# Altium schematic sheet TFT-Display.SchDoc
size B; SheetNumber: 13; SheetTotal: 17
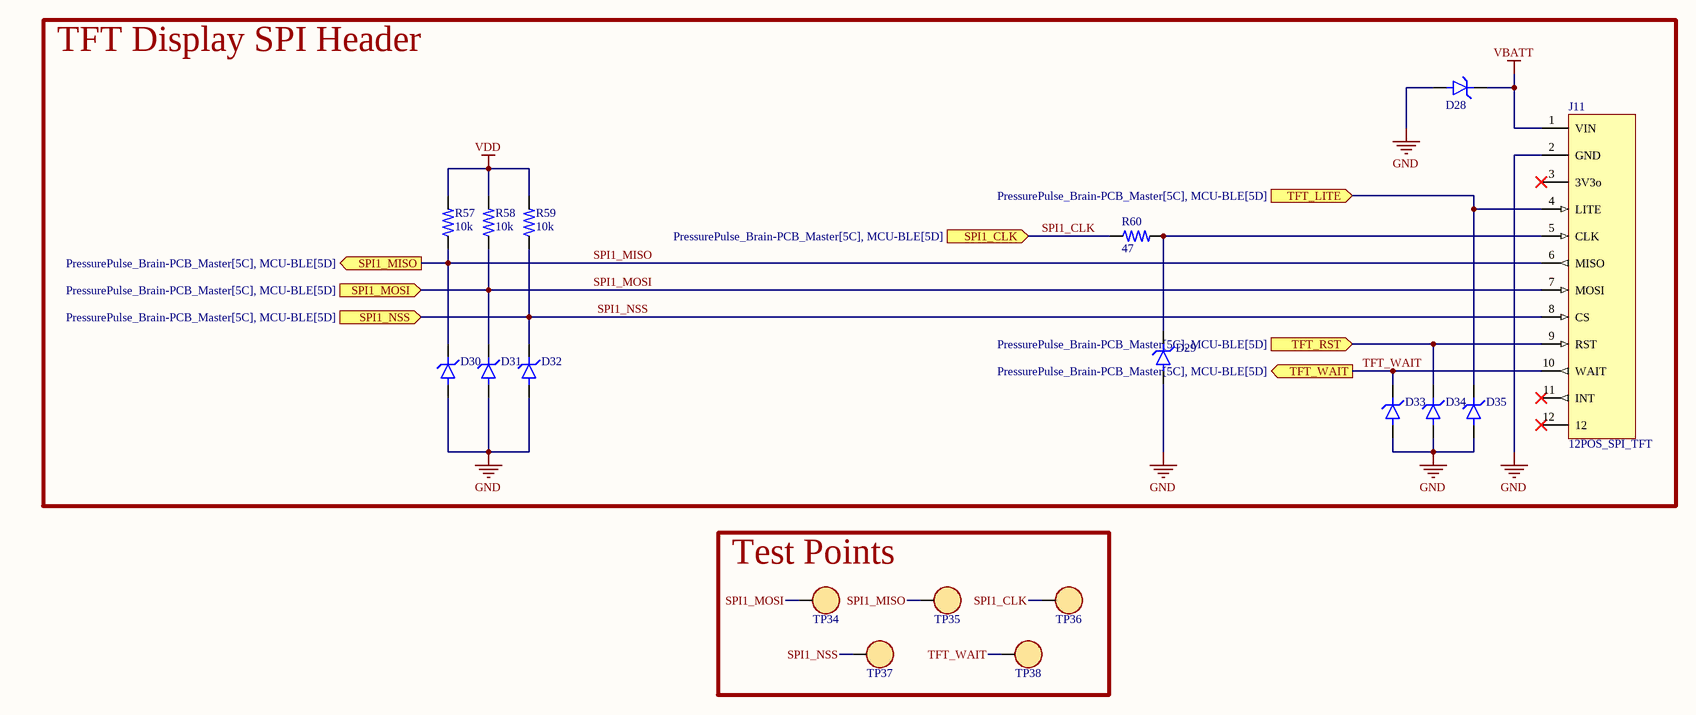
[diagram p0: TFT-Display.SchDoc]

## Parts
D28  RCLAMP0521P.TCT  [BDFN2C051V40]  (value not drawn)
D29  RCLAMP0521P.TCT  [BDFN2C051V40]  (value not drawn)
D30  RCLAMP0521P.TCT  [BDFN2C051V40]  (value not drawn)
D31  RCLAMP0521P.TCT  [BDFN2C051V40]  (value not drawn)
D32  RCLAMP0521P.TCT  [BDFN2C051V40]  (value not drawn)
D33  RCLAMP0521P.TCT  [BDFN2C051V40]  (value not drawn)
D34  RCLAMP0521P.TCT  [BDFN2C051V40]  (value not drawn)
D35  RCLAMP0521P.TCT  [BDFN2C051V40]  (value not drawn)
J11  12POS_SPI_TFT  [2.54MM-12POS_TFT]
R57  value 10k  [0402R]  (hidden comment: RES)
R58  value 10k  [0402R]  (hidden comment: RES)
R59  value 10k  [0402R]  (hidden comment: RES)
R60  value 47  [0402R]  (hidden comment: RES)
TP34  RH-5019  [TP - RH-5019]  (value not drawn)
TP35  RH-5019  [TP - RH-5019]  (value not drawn)
TP36  RH-5019  [TP - RH-5019]  (value not drawn)
TP37  RH-5019  [TP - RH-5019]  (value not drawn)
TP38  RH-5019  [TP - RH-5019]  (value not drawn)

## Blocks framed on the sheet
TFT Display SPI Header: D28-D35 J11 R57-R60
Test Points: TP34-TP38

## Ports
SPI1_CLK (in, see PressurePulse_Brain-PCB_Master[5C], MCU-BLE[5D]), SPI1_MISO (out, see PressurePulse_Brain-PCB_Master[5C], MCU-BLE[5D]), SPI1_MOSI (in, see PressurePulse_Brain-PCB_Master[5C], MCU-BLE[5D]), SPI1_NSS (in, see PressurePulse_Brain-PCB_Master[5C], MCU-BLE[5D]), TFT_LITE (in, see PressurePulse_Brain-PCB_Master[5C], MCU-BLE[5D]), TFT_RST (in, see PressurePulse_Brain-PCB_Master[5C], MCU-BLE[5D]), TFT_WAIT (out, see PressurePulse_Brain-PCB_Master[5C], MCU-BLE[5D])

## Nets
GND: D28.A D29.A D30.A D31.A D32.A D33.A D34.A D35.A J11.2(GND)
VBATT: D28.K J11.1(VIN)
VDD: R57.2 R58.2 R59.2
SPI1_CLK: R60.1 TP36.1 ; port SPI1_CLK
SPI1_MISO: D30.K J11.6(MISO) R57.1 TP35.1 ; port SPI1_MISO
SPI1_MOSI: D31.K J11.7(MOSI) R58.1 TP34.1 ; port SPI1_MOSI
SPI1_NSS: D32.K J11.8(CS) R59.1 TP37.1 ; port SPI1_NSS
TFT_LITE: D35.K J11.4(LITE) ; port TFT_LITE
TFT_RST: D34.K J11.9(RST) ; port TFT_RST
TFT_WAIT: D33.K J11.10(WAIT) TP38.1 ; port TFT_WAIT
NetD29_K: D29.K J11.5(CLK) R60.2

Not connected (* = marked no-connect by the designer): J11 3(3V3o)* 11(INT)* 12*

## Library data of the parts
D28-D35 = TVS DIODE: 25V Clamp 4A (8/20µs) Ipp Tvs Diode Surface Mount SLP1006P2; MFR: BORN; Type: SMD; Value: BDFN2C051V40; MFR PN: BDFN2C051V40; JLCPCB PN: C152023
J11 = 12POS_SPI_TFT: Value: DNS; MFR: *; MFR PN: *; JLCPCB PN: *
R57-R60 = RES: Resistor; MFR PN: *; MFR: *
  R57-R59: JLCPCB PN: C843837
  R60: JLCPCB PN: *
TP34-TP38 = TEST POINT: MFR: ronghe; MFR PN: RH-5019; Value: RH-5019; JLCPCB PN: C5199800